# Altium project LM2596.PrjPcb
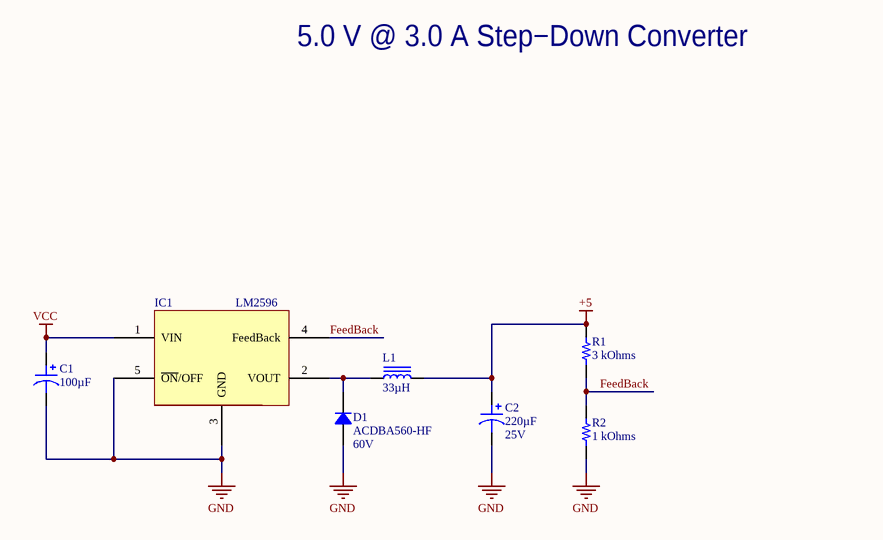
[diagram p0: LM2596.SchDoc]
1 sheet, 7 parts. Net scope: global (net labels, ports and power ports of the same name join across sheets).
Board file: LM2596.PcbDoc

## Sheet LM2596.SchDoc
size A4; SheetNumber: 1; SheetTotal: 1

### Parts
C1  100µF  [CAP TH ALUM ELEC D8.00mm S3.50mm H12.50mm]
C2  220µF  Voltage - Rated: 25V  [CAP TH ALUM ELEC D6.30mm S2.50mm H12.50mm]
D1  ACDBA560-HF  Voltage - DC Reverse (Vr) (Max): 60V  [DO214AC SMA]
IC1  LM2596  [LM2596]
L1  33µH  [BOURNS SRR1280]
R1  3 kOhms  [RES 0805_2012]
R2  1 kOhms  [RES 0805_2012]

### Nets
+5: C2.1 L1.2 R1.2
GND: C1.2 C2.2 D1.1 IC1.3(GND) IC1.5(~{ON}/OFF) R2.1
VCC: C1.1 IC1.1(VIN)
FeedBack: IC1.4(FeedBack) R1.1 R2.2
NetD1_2: D1.2 IC1.2(VOUT) L1.1

### Notes on the sheet
- 5.0 V @ 3.0 A Step−Down Converter

### Library data of the parts
C1 = ECA-1HM101: CAP ALUM 100UF 20% 50V RADIAL; Manufacturer: Panasonic Electronic Components; Lifetime @ Temp.: 2000 Hrs @ 85°C; Polarization: Polar; Ripple Current @ High Frequency: 425mA @ 10kHz; Ripple Current @ Low Frequency: 250mA @ 120Hz; Part Number: ECA-1HM101; Applications: General Purpose; Capacitance: 100µF; ComponentLink1Description: Datasheet; ComponentLink1URL: //media.digikey.com/pdf/Data%20Sheets/Panasonic%20Electronic%20Components/ECA-xxM%20Series,TypeA.pdf; ComponentLink2Description: DigiKey Link; ComponentLink2URL: http://digikey.com/product-detail/en/panasonic-electronic-components/ECA-1HM101/P5182-ND/245041; Device Package: Radial, Can; Height - Seated (Max): 0.492" (12.50mm); LastUpdated: 7.09.2020 05:24:52; Lead Spacing: 0.138" (3.50mm); Lifecycle Status: Active; Minimum Order: 1; Mounting Type: Through Hole; Operating Temperature: -40°C ~ 85°C; Package / Case: Radial, Can; Packaging: Bulk; PartId: 7199; Part Status: Active; Price: 0.31; Series: M; Size / Dimension: 0.315" Dia (8.00mm); Supplier 1: DigiKey; Supplier Part Number 1: P5182-ND; Tolerance: ±20%; Value: 100µF; Voltage - Rated: 50V
C2 = 25YXJ220M6.3X11: CAP ALUM 220UF 20% 25V RADIAL; Manufacturer: Rubycon; Impedance: 220 mOhms; Lifetime @ Temp.: 7000 Hrs @ 105°C; Polarization: Polar; Ripple Current @ High Frequency: 400mA @ 100kHz; Ripple Current @ Low Frequency: 280mA @ 120Hz; Part Number: 25YXJ220M6.3X11; Applications: General Purpose; Capacitance: 220µF; ComponentLink1Description: Datasheet; ComponentLink1URL: http://www.rubycon.co.jp/en/catalog/e_pdfs/aluminum/e_yxj.pdf; ComponentLink2Description: DigiKey Link; ComponentLink2URL: http://digikey.com/product-detail/en/rubycon/25YXJ220M6.3X11/1189-2913-ND/3563124; Device Package: Radial, Can; Height - Seated (Max): 0.492" (12.50mm); LastUpdated: 4.09.2020 01:05:50; Lead Spacing: 0.098" (2.50mm); Lifecycle Status: Active; Minimum Order: 1; Mounting Type: Through Hole; Operating Temperature: -40°C ~ 105°C; Package / Case: Radial, Can; Packaging: Bulk; PartId: 20944; Part Status: Active; Price: 0.27; Series: YXJ; Size / Dimension: 0.248" Dia (6.30mm); Supplier 1: DigiKey; Supplier Part Number 1: 1189-2913-ND; Tolerance: ±20%; Value: 220µF
D1 = ACDBA560-HF: DIODE SCHOTTKY 60V 5A DO214AC; Manufacturer: Comchip Technology; Capacitance @ Vr, F: 250pF @ 4V, 1MHz; Current - Average Rectified (Io): 5A (DC); Current - Reverse Leakage @ Vr: 500µA @ 60V; Speed: Fast Recovery =< 500ns, > 200mA (Io); Voltage - Forward (Vf) (Max) @ If: 700mV @ 5A; Part Number: ACDBA560-HF; ComponentLink1Description: Datasheet; ComponentLink1URL: http://www.comchiptech.com/admin/files/product/ACDBA560-HF%20RevA201382.pdf; ComponentLink2Description: DigiKey Link; ComponentLink2URL: http://digikey.com/product-detail/en/comchip-technology/ACDBA560-HF/641-2078-1-ND/10131664; Diode Type: Schottky; LastUpdated: 2.09.2020 01:19:04; Lifecycle Status: Active; Minimum Order: 1; Mounting Type: Surface Mount; Operating Temperature - Junction: -55°C ~ 125°C; Package / Case: DO-214AC, SMA; Packaging: TapeAndReel; PartId: 1832; Part Status: Active; Price: 0.13; Series: Automotive, AEC-Q101; Supplier 1: DigiKey; Supplier Part Number 1: 641-2078-1-ND; Supplier Device Package: DO-214AC (SMA)
L1 = SRR1280-330M: FIXED IND 33UH 3.5A 57 MOHM SMD; Manufacturer: Bourns Inc.; Current - Saturation: 3.3A; DC Resistance (DCR): 57mOhm Max; Frequency - Self Resonant: 9.5MHz; Inductance Frequency - Test: 100kHz; Material - Core: Ferrite; Q @ Freq: 28 @ 2.52MHz; Shielding: Shielded; Tolerance: ±20%; Type: Wirewound; Part Number: SRR1280-330M; ComponentLink1Description: Datasheet; ComponentLink1URL: https://www.bourns.com/docs/Product-Datasheets/SRR1280.pdf; ComponentLink2Description: DigiKey Link; ComponentLink2URL: http://digikey.com/product-detail/en/bourns-inc/SRR1280-330M/SRR1280-330MCT-ND/2127440; Current Rating (Amps): 3.5A; Device Package: Nonstandard; Height - Seated (Max): 0.315" (8.00mm); Inductance: 33µH; LastUpdated: 2.09.2020 01:22:09; Lifecycle Status: Active; Minimum Order: 1; Mounting Type: Surface Mount; Operating Temperature: -40°C ~ 125°C; Package / Case: Nonstandard; Packaging: TapeAndReel; PartId: 25; Part Status: Active; Price: 0.65; Series: SRR1280; Size / Dimension: 0.492" L x 0.492" W (12.50mm x 12.50mm); Supplier 1: DigiKey; Supplier Part Number 1: SRR1280-330MCT-ND; Value: 33µH
R1 = RPC0805JT3K00: RES 3K OHM 5% 1/4W 0805; Manufacturer: Stackpole Electronics Inc; Power (Watts): 0.25W, 1/4W; Temperature Coefficient: ±100ppm/°C; Part Number: RPC0805JT3K00; Value: 3 kOhms; ComponentLink1Description: Datasheet; ComponentLink1URL: https://www.seielect.com/catalog/sei-rpc.pdf; ComponentLink2Description: DigiKey Link; ComponentLink2URL: http://digikey.com/product-detail/en/stackpole-electronics-inc/RPC0805JT3K00/RPC0805JT3K00CT-ND/5766019; Composition: Thick Film; Device Package: 0805 (2012 Metric); Features: Automotive AEC-Q200, Pulse Withstanding; Height - Seated (Max): 0.024" (0.60mm); LastUpdated: 2.09.2020 01:14:56; Lifecycle Status: Active; Minimum Order: 1; Number of Terminations: 2; Operating Temperature: -55°C ~ 155°C; Package / Case: 0805 (2012 Metric); Packaging: TapeAndReel; PartId: 40639; Part Status: Active; Price: 0.02; Ratings: AEC-Q200; Resistance: 3 kOhms; Series: RPC; Size / Dimension: 0.079" L x 0.049" W (2.00mm x 1.25mm); Supplier 1: DigiKey; Supplier Part Number 1: RPC0805JT3K00CT-ND; Supplier Device Package: 0805; Tolerance: ±5%
R2 = RPC0805JT1K00: RES 1K OHM 5% 1/4W 0805; Manufacturer: Stackpole Electronics Inc; Power (Watts): 0.25W, 1/4W; Temperature Coefficient: ±100ppm/°C; Part Number: RPC0805JT1K00; Value: 1 kOhms; ComponentLink1Description: Datasheet; ComponentLink1URL: https://www.seielect.com/catalog/sei-rpc.pdf; ComponentLink2Description: DigiKey Link; ComponentLink2URL: http://digikey.com/product-detail/en/stackpole-electronics-inc/RPC0805JT1K00/RPC0805JT1K00CT-ND/3043931; Composition: Thick Film; Device Package: 0805 (2012 Metric); Features: Automotive AEC-Q200, Pulse Withstanding; Height - Seated (Max): 0.024" (0.60mm); LastUpdated: 2.09.2020 01:14:52; Lifecycle Status: Active; Minimum Order: 1; Number of Terminations: 2; Operating Temperature: -55°C ~ 155°C; Package / Case: 0805 (2012 Metric); Packaging: TapeAndReel; PartId: 42221; Part Status: Active; Price: 0.02; Ratings: AEC-Q200; Resistance: 1 kOhms; Series: RPC; Size / Dimension: 0.079" L x 0.049" W (2.00mm x 1.25mm); Supplier 1: DigiKey; Supplier Part Number 1: RPC0805JT1K00CT-ND; Supplier Device Package: 0805; Tolerance: ±5%